# Altium schematic sheet Sheet_1_2022-08-17.schdoc
size 305 x 222 mm
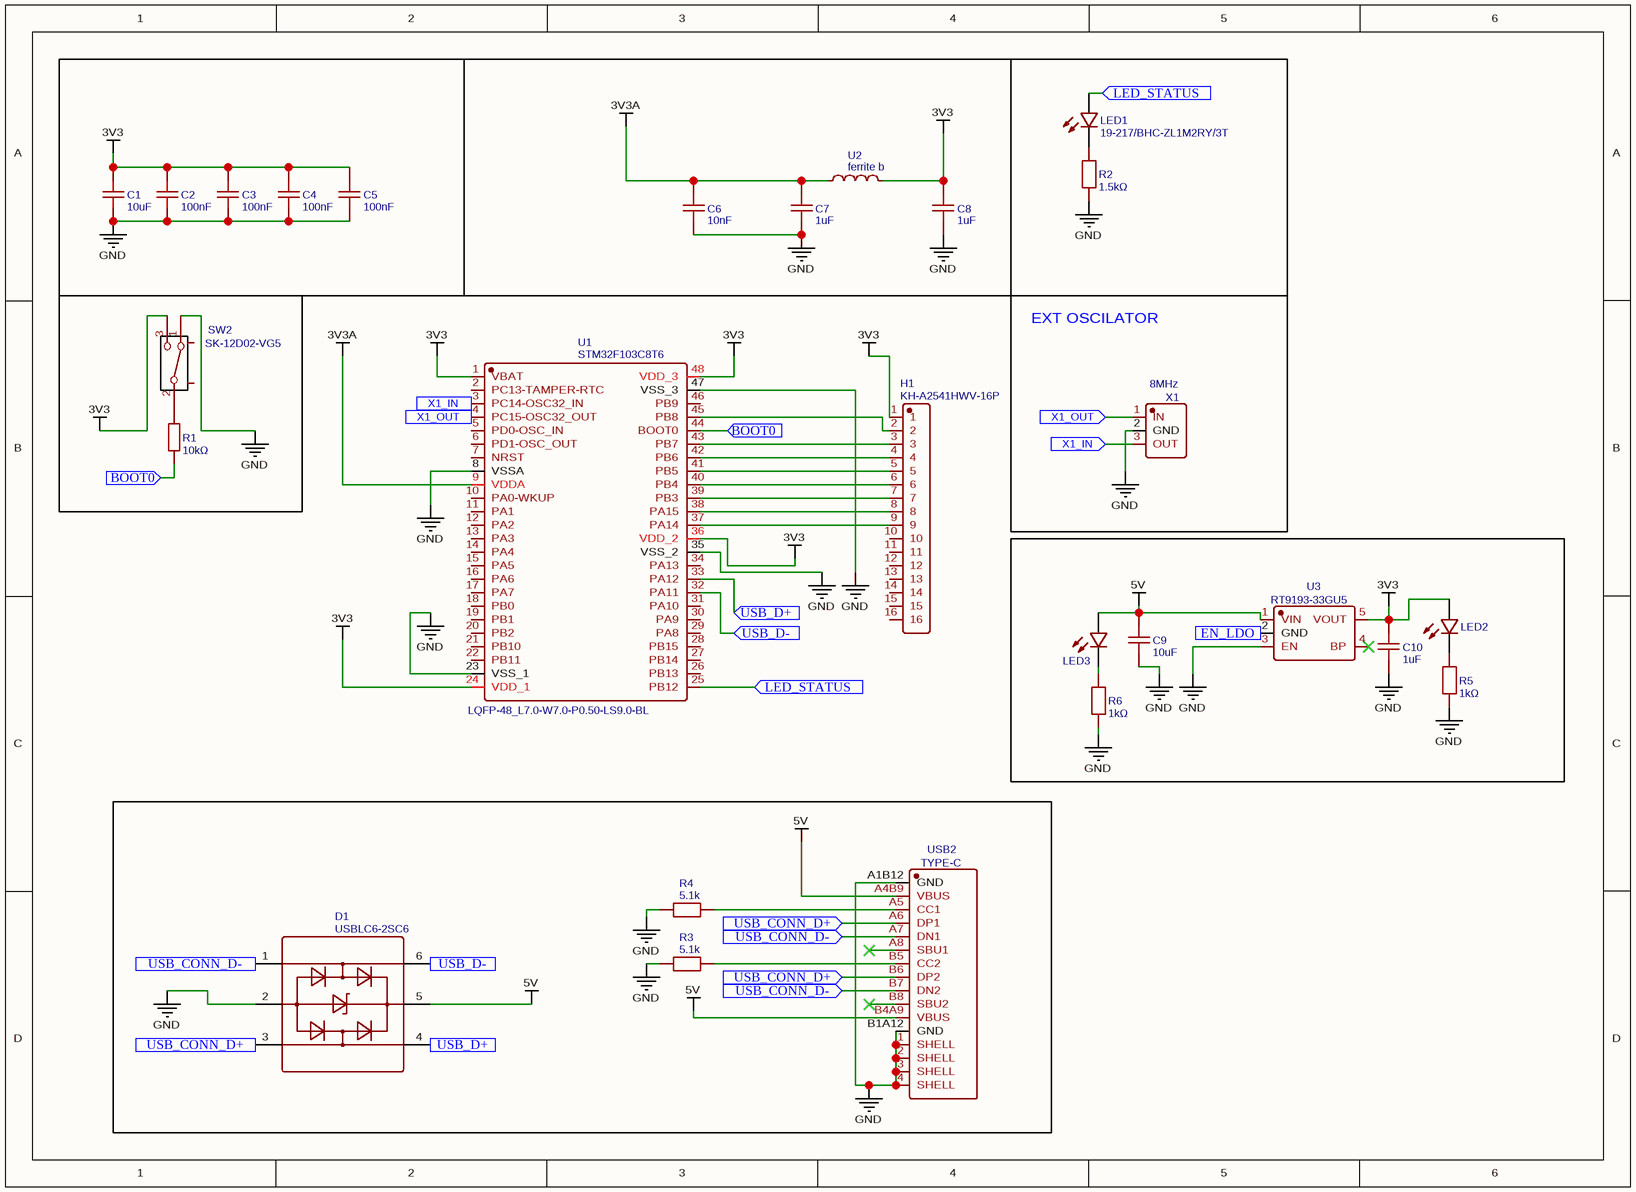
[diagram p0: Sheet_1_2022-08-17.schdoc]

## Parts
C1  10uF  [C0402]
C2  100nF  [C0402]
C3  100nF  [C0402]
C4  100nF  [C0402]
C5  100nF  [C0402]
C6  10nF  [C0402]
C7  1uF  [C0402]
C8  1uF  [C0402]
C9  10uF  [C0402]
C10  1uF  [C0402]
D1  USBLC6-2SC6  [SOT-23-6_L2.9-W1.6-P0.95-LS2.8-BR]
H1  KH-A2541HWV-16P  [HDR-TH_16P-P2.54-V-F]
LED1  19-217/BHC-ZL1M2RY/3T  [LED0603-R-RD_BLUE]
LED2  19-217/BHC-ZL1M2RY/3T  [LED0603-R-RD_BLUE]  (value not drawn)
LED3  19-217/BHC-ZL1M2RY/3T  [LED0603-R-RD_BLUE]  (value not drawn)
R1  10kΩ  [R0402]
R2  1.5kΩ  [R0402]
R3  5.1k  [R0805]
R4  5.1k  [R0805]
R5  1kΩ  [R0402]
R6  1kΩ  [R0402]
SW2  SK-12D02-VG5  [SW-TH_SK-12D02VG3]
U1  STM32F103C8T6  [LQFP-48_L7.0-W7.0-P0.50-LS9.0-BL]
U2  ferrite b  [L0603]
U3  RT9193-33GU5  [SC-70-5_L2.1-W1.3-P0.65-LS2.1-BL]
USB2  TYPE-C  [USB-C-SMD_TYPE-C16PIN_C668624]
X1  8MHz  [OSC-SMD_3P-L3.2-W1.3-P1.20]

## Blocks framed on the sheet
EXT OSCILATOR: X1

## Ports
BOOT0 (in), EN_LDO (in), LED_STATUS (in), USB_CONN_D+ (in), USB_CONN_D- (in), USB_D+ (in), USB_D- (in), X1_IN (in), X1_OUT (in)

## Nets
3V3: C1.2 C2.2 C3.2 C4.2 C5.2 C8.2 C10.2 H1.1 LED2.1(A) SW2.3 U1.1(VBAT) U1.24(VDD_1) U1.36(VDD_2) U1.48(VDD_3) U2.2 U3.5(VOUT)
3V3A: C6.2 C7.2 U1.9(VDDA) U2.1
5V: C9.2 D1.5 LED3.1(A) U3.1(VIN) USB2.A4B9(VBUS) USB2.B4A9(VBUS)
GND: C1.1 C2.1 C3.1 C4.1 C5.1 C6.1 C7.1 C8.1 C9.1 C10.1 D1.2 R2.1 R3.1 R4.1 R5.1 R6.1 SW2.1 U1.8(VSSA) U1.23(VSS_1) U1.35(VSS_2) U1.47(VSS_3) U3.3(EN) USB2.1(SHELL) USB2.2(SHELL) USB2.3(SHELL) USB2.4(SHELL) USB2.A1B12(GND) USB2.B1A12(GND) X1.2(GND)
BOOT0: R1.1 U1.44(BOOT0) ; port BOOT0
EN_LDO: U3.2(GND) ; port EN_LDO
LED_STATUS: LED1.1(A) U1.25(PB12) ; port LED_STATUS
USB_CONN_D+: D1.3 USB2.A6(DP1) USB2.B6(DP2) ; port USB_CONN_D+
USB_CONN_D-: D1.1 USB2.A7(DN1) USB2.B7(DN2) ; port USB_CONN_D-
USB_D+: D1.4 U1.33(PA12) ; port USB_D+
USB_D-: D1.6 U1.32(PA11) ; port USB_D-
X1_IN: U1.3(PC14-OSC32_IN) X1.3(OUT) ; port X1_IN
X1_OUT: U1.4(PC15-OSC32_OUT) X1.1(IN) ; port X1_OUT
NetH1_2: H1.2 U1.45(PB8)
NetH1_3: H1.3 U1.43(PB7)
NetH1_4: H1.4 U1.42(PB6)
NetH1_5: H1.5 U1.41(PB5)
NetH1_6: H1.6 U1.40(PB4)
NetH1_7: H1.7 U1.39(PB3)
NetH1_8: H1.8 U1.38(PA15)
NetH1_9: H1.9 U1.37(PA14)
NetLED1_2: LED1.2(C) R2.2
NetLED2_2: LED2.2(C) R5.2
NetLED3_2: LED3.2(C) R6.2
NetR1_2: R1.2 SW2.2
NetR3_2: R3.2 USB2.B5(CC2)
NetR4_2: R4.2 USB2.A5(CC1)

Not connected (* = marked no-connect by the designer): H1 10 11 12 13 14 15 16; SW2 4 5; U1 2(PC13-TAMPER-RTC) 5(PD0-OSC_IN) 6(PD1-OSC_OUT) 7(NRST) 10(PA0-WKUP) 11(PA1) 12(PA2) 13(PA3) 14(PA4) 15(PA5) 16(PA6) 17(PA7) 18(PB0) 19(PB1) 20(PB2) 21(PB10) 22(PB11) 26(PB13) 27(PB14) 28(PB15) 29(PA8) 30(PA9) 31(PA10) 34(PA13) 46(PB9); U3 4(BP)*; USB2 A8(SBU1)* B8(SBU2)*

## Notes on the sheet
- (in symbol STM32F103C8T6) LQFP-48_L7.0-W7.0-P0.50-LS9.0-BL

## Library data of the parts
C1 C9 = 10uF: BOM_Manufacturer: FH(风华); BOM_Manufacturer Part: 0402X106M100NT; nameAlias: Capacitance; Contributor: LCSC; BOM_Supplier: LCSC; BOM_Supplier Part: C2846677; BOM_JLCPCB Part Class: Extended Part; spicePre: C; spiceSymbolName: 0402X106M100NT
C2-C5 = 100nF: BOM_Manufacturer: FH(风华); BOM_Manufacturer Part: 0402B104K100NT; nameAlias: Capacitance; Contributor: LCSC; BOM_Supplier: LCSC; BOM_Supplier Part: C880295; BOM_JLCPCB Part Class: Extended Part; spicePre: C; spiceSymbolName: 0402B104K100NT
C6 = 10nF: BOM_Manufacturer: EYANG(Shenzhen Eyang Tech Development); BOM_Manufacturer Part: C0402X7R103K100NTB; nameAlias: Capacitance; Contributor: LCSC; BOM_Supplier: LCSC; BOM_Supplier Part: C783637; BOM_JLCPCB Part Class: Extended Part; spicePre: C; spiceSymbolName: C0402X7R103K100NTB
C7 C8 C10 = 1uF: BOM_Manufacturer: FH; BOM_Manufacturer Part: 0402X105K100NT; nameAlias: Capacitance; Contributor: LCSC; BOM_Supplier: LCSC; BOM_Supplier Part: C157353; BOM_JLCPCB Part Class: Extended Part; spicePre: C; spiceSymbolName: 0402X105K100NT
D1 = USBLC6-2SC6: BOM_Manufacturer: STMicroelectronics; BOM_Supplier: LCSC; BOM_Manufacturer Part: USBLC6-2SC6; BOM_Supplier Part: C7519; BOM_JLCPCB Part Class: Extended Part; spicePre: D; spiceSymbolName: USBLC6-2SC6
H1 = KH-A2541HWV-16P: BOM_Manufacturer: kinghelm(金航标); Contributor: LCSC; BOM_Supplier: LCSC; BOM_Supplier Part: C2833317; BOM_Manufacturer Part: KH-A2541HWV-16P; spicePre: H; spiceSymbolName: KH-A2541HWV-16P
LED1-LED3 = 19-217/BHC-ZL1M2RY/3T: BOM_Manufacturer: EVERLIGHT; BOM_Supplier: LCSC; BOM_Manufacturer Part: 19-217/BHC-ZL1M2RY/3T; BOM_Supplier Part: C72041; BOM_JLCPCB Part Class: Basic Part; spicePre: L; spiceSymbolName: 19-217/BHC-ZL1M2RY/3T
R1 = 10kΩ: BOM_Manufacturer: PANASONIC; BOM_Manufacturer Part: ERJ-2RKF1002X; Resistance (Ohms): 10K; nameAlias: Resistance; Contributor: LCSC; BOM_Supplier: LCSC; BOM_Supplier Part: C191123; BOM_JLCPCB Part Class: Extended Part; spicePre: R; spiceSymbolName: ERJ-2RKF1002X
R2 = 1.5kΩ: BOM_Manufacturer: PANASONIC; BOM_Manufacturer Part: ERA2AEB152X; Resistance (Ohms): 1.5K; nameAlias: Resistance; Contributor: LCSC; BOM_Supplier: LCSC; BOM_Supplier Part: C445600; BOM_JLCPCB Part Class: Extended Part; spicePre: R; spiceSymbolName: ERA2AEB152X
R3 R4 = 5.1k: BOM_Manufacturer Part: RS-05K5101FT; BOM_Manufacturer: FH; nameAlias: Value(Ω); Contributor: LCEDA_Lib; BOM_Supplier Part: C118848; BOM_Supplier: LCSC; spicePre: R; spiceSymbolName: R_0805_EU
R5 R6 = 1kΩ: BOM_Manufacturer: PANASONIC; BOM_Manufacturer Part: ERA2AEB152X; Resistance (Ohms): 1.5K; nameAlias: Resistance; Contributor: LCSC; BOM_Supplier: LCSC; BOM_Supplier Part: C445600; BOM_JLCPCB Part Class: Extended Part; spicePre: R; spiceSymbolName: ERA2AEB152X
SW2 = SK-12D02-VG5: BOM_Manufacturer: Rectangular Connectors - Contacts; Contributor: LCSC; BOM_Supplier: LCSC; BOM_Supplier Part: C136722; BOM_Manufacturer Part: SK-12D02-VG5; spicePre: S; spiceSymbolName: SK-12D02-VG5
U1 = STM32F103C8T6: BOM_Manufacturer: STMicroelectronics; Package Display: Yes; timeStamp: 1455028086; BOM_Supplier: LCSC; BOM_Manufacturer Part: STM32F103C8T6; BOM_Supplier Part: C8734; BOM_JLCPCB Part Class: Basic Part; spicePre: U; spiceSymbolName: STM32F103C8T6
U2 = ferrite b: BOM_Manufacturer: Murata Electronics; BOM_Manufacturer Part: BLM18PG121SN1D; Contributor: LCSC; BOM_Supplier: LCSC; BOM_Supplier Part: C14709; BOM_JLCPCB Part Class: Extended Part; spicePre: U; spiceSymbolName: BLM18PG121SN1D_C14709
U3 = RT9193-33GU5: BOM_Manufacturer: Richtek Tech; Contributor: LCSC; BOM_Supplier: LCSC; BOM_Supplier Part: C425797; BOM_Manufacturer Part: RT9193-33GU5; BOM_JLCPCB Part Class: Extended Part; spicePre: U; spiceSymbolName: RT9193-33GU5
USB2 = TYPE-C: BOM_Manufacturer: SHOU HAN; BOM_Manufacturer Part: TYPE-C 16P(073); Contributor: LCSC; BOM_Supplier: LCSC; BOM_Supplier Part: C668624; spicePre: U; spiceSymbolName: TYPE-C 16P(073)
X1 = 8MHz: BOM_Manufacturer: muRata(村田); BOM_Manufacturer Part: CSTNE8M00G520000R0; Contributor: LCSC; nameAlias: Frequency; BOM_Supplier: LCSC; BOM_Supplier Part: C907975; BOM_JLCPCB Part Class: Extended Part; spicePre: X; spiceSymbolName: CSTNE8M00G520000R0